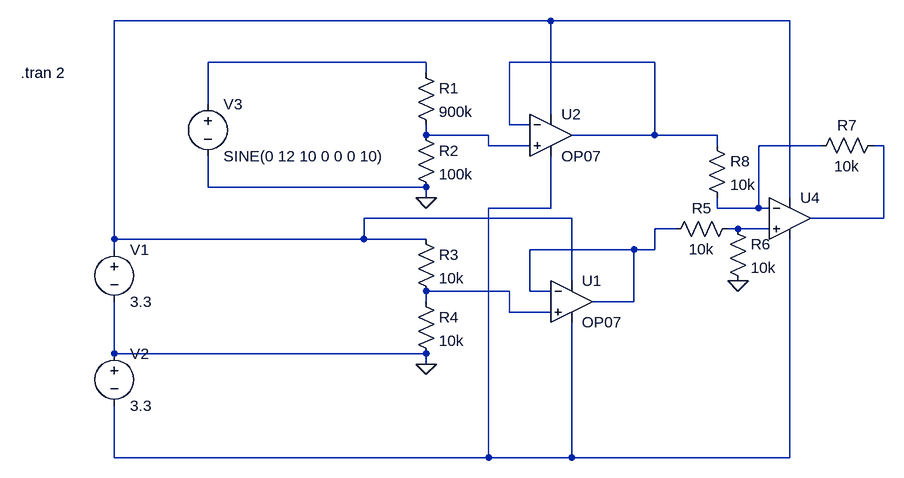
[diagram p0: schematic signal-conditioner.asc]
signal-conditioner.asc, the LTspice schematic file:
Version 4
SHEET 1 1152 680
WIRE 144 0 -528 0
WIRE 512 0 144 0
WIRE -48 64 -384 64
WIRE 304 64 80 64
WIRE -48 80 -48 64
WIRE -384 128 -384 64
WIRE 144 144 144 0
WIRE 80 160 80 64
WIRE 112 160 80 160
WIRE -48 176 -48 160
WIRE 48 176 -48 176
WIRE 304 176 304 64
WIRE 304 176 176 176
WIRE 400 176 304 176
WIRE 48 192 48 176
WIRE 112 192 48 192
WIRE 400 192 400 176
WIRE 560 192 464 192
WIRE 656 192 640 192
WIRE -384 256 -384 208
WIRE -48 256 -384 256
WIRE -48 272 -48 256
WIRE 512 272 512 0
WIRE 144 288 144 208
WIRE 144 288 48 288
WIRE 400 288 400 272
WIRE 464 288 464 192
WIRE 464 288 400 288
WIRE 480 288 464 288
WIRE 176 304 -144 304
WIRE 656 304 656 192
WIRE 656 304 544 304
WIRE 336 320 304 320
WIRE 432 320 416 320
WIRE 480 320 432 320
WIRE -528 336 -528 0
WIRE -144 336 -144 304
WIRE -144 336 -528 336
WIRE -48 336 -144 336
WIRE -528 352 -528 336
WIRE 272 352 112 352
WIRE 304 352 304 320
WIRE 304 352 272 352
WIRE 176 400 176 304
WIRE 80 416 -48 416
WIRE 112 416 112 352
WIRE 144 416 112 416
WIRE -48 432 -48 416
WIRE 272 432 272 352
WIRE 272 432 208 432
WIRE 80 448 80 416
WIRE 144 448 80 448
WIRE -528 512 -528 432
WIRE -48 512 -528 512
WIRE -48 528 -48 512
WIRE -528 672 -528 592
WIRE 48 672 48 288
WIRE 48 672 -528 672
WIRE 176 672 176 464
WIRE 176 672 48 672
WIRE 512 672 512 336
WIRE 512 672 176 672
FLAG -48 272 0
FLAG -48 528 0
FLAG 432 400 0
SYMBOL res -64 64 R0
SYMATTR InstName R1
SYMATTR Value 900k
SYMBOL res -64 160 R0
SYMATTR InstName R2
SYMATTR Value 100k
SYMBOL res -64 320 R0
SYMATTR InstName R3
SYMATTR Value 10k
SYMBOL res -64 416 R0
SYMATTR InstName R4
SYMATTR Value 10k
SYMBOL voltage -528 336 R0
SYMATTR InstName V1
SYMATTR Value 3.3
SYMBOL OpAmps\\OP07 176 368 R0
SYMATTR InstName U1
SYMBOL OpAmps\\OP07 144 112 R0
SYMATTR InstName U2
SYMBOL voltage -528 496 R0
SYMATTR InstName V2
SYMATTR Value 3.3
SYMBOL res 432 304 R90
WINDOW 0 0 56 VBottom 2
WINDOW 3 32 56 VTop 2
SYMATTR InstName R5
SYMATTR Value 10k
SYMBOL res 416 304 R0
SYMATTR InstName R6
SYMATTR Value 10k
SYMBOL res 656 176 R90
WINDOW 0 0 56 VBottom 2
WINDOW 3 32 56 VTop 2
SYMATTR InstName R7
SYMATTR Value 10k
SYMBOL res 384 176 R0
SYMATTR InstName R8
SYMATTR Value 10k
SYMBOL voltage -384 112 R0
WINDOW 123 0 0 Left 0
WINDOW 39 0 0 Left 0
SYMATTR InstName V3
SYMATTR Value SINE(0 12 10 0 0 0 10)
SYMBOL OpAmps\\UniversalOpAmp 512 304 R0
SYMATTR InstName U4
TEXT -672 80 Left 2 !.tran 2

The netlist it stands for:
* signal-conditioner.asc
R1 N002 N004 900k
R2 N004 0 100k
R3 N001 N010 10k
R4 N010 0 10k
V1 N001 0 3.3
XU1 N010 N008 N001 N007 N008 LT1001  ; OP07, pins In+ In- V+ V- OUT
XU2 N004 N003 N001 N007 N003 LT1001  ; OP07, pins In+ In- V+ V- OUT
V2 0 N007 3.3
R5 N009 N008 10k
R6 N009 0 10k
R7 N006 N005 10k
R8 N003 N005 10k
V3 N002 0 SINE(0 12 10 0 0 0 10)
XU4 N009 N005 N001 N007 N006 level1 Avol=1Meg GBW=10Meg Vos=0 En=0 Enk=0 In=0 Ink=0 Rin=500Meg  ; pins In+ In- V+ V- OUT
.tran 2
.lib LTC.lib
.lib UniversalOpAmp1.lib
.backanno
.end